# EAGLE schematic PowerDeliveryBoard (EAGLE 9.5.1)
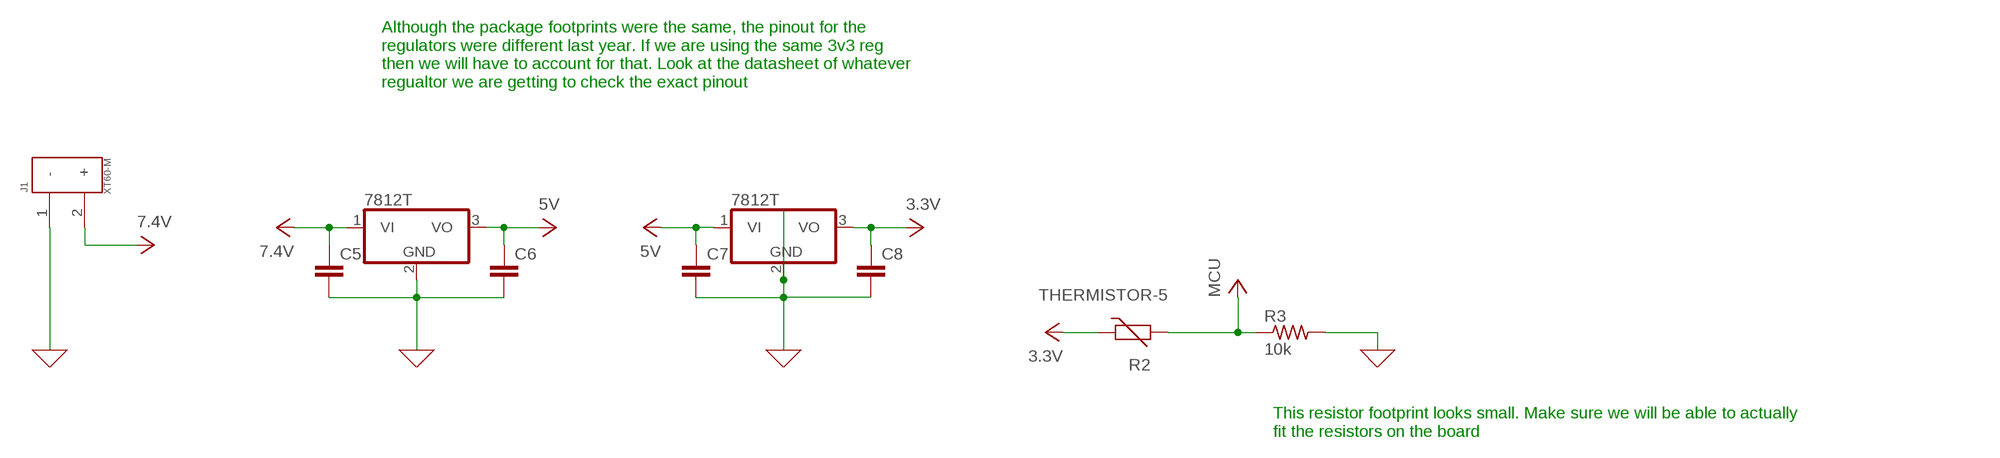
[diagram p0: schematic, sheet 1]

## Parts
C5  C2,5-3  [C2.5-3]
C6  C2,5-3  [C2.5-3]
C7  C2,5-3  [C2.5-3]
C8  C2,5-3  [C2.5-3]
IC1  7812T  [TO220H]
IC2  7812T  [TO220H]
J1  XT60-M  [AMASS_XT60-M]
R2  THERMISTOR-5  [R-5]
R3  10k  R-US_0204/2V  [0204V]

## Nets
0: C5.2 C6.2 C7.2 C8.2 IC1.2(GND) IC2.2(GND) J1.1(-) R3.2 ; supply symbol labelled GND
VCC: C5.1 C6.1 C7.1 C8.1 IC1.1(VI) IC1.3(VO) IC2.1(VI) IC2.3(VO) J1.2(+) R2.1 R2.2 R3.1 ; supply symbol labelled 7.4V, 5V, 3.3V, MCU

## Notes on the sheet
- Although the package footprints were the same, the pinout for the
  regulators were different last year. If we are using the same 3v3 reg 
  then we will have to account for that. Look at the datasheet of whatever
  regualtor we are getting to check the exact pinout
- This resistor footprint looks small. Make sure we will be able to actually
  fit the resistors on the board

## Library data of the parts
C5-C8 = capacitor-wima:C: CAPACITOR naming: grid - package width
IC1 IC2 = linear:78*: Positive VOLTAGE REGULATOR Source: http://cache.national.com/ds/LM/LM78L05.pdf http://www.fairchildsemi.com/ds/LM/LM7805.pdf
J1 = XT60-M:XT60-M: DC supply; XT60; male; PIN:2; for cable; soldered; 60A; 500V; AVAILABILITY: Unavailable; DESCRIPTION: Plug; DC supply; XT60; male; PIN: 2; for cable; soldered; 30A; 500V; MF: AMASS; MP: XT60-M; PACKAGE: Package; PRICE: None
R2 = varistor:THERMISTOR: THERMISTOR
R3 = rcl:R-US_: RESISTOR, American symbol; SPICEPREFIX: R